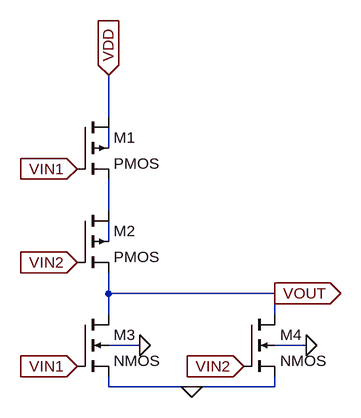
[diagram p0: schematic nor.asc]
nor.asc, the LTspice schematic file:
Version 4
SHEET 1 1100 680
WIRE 352 48 352 -16
WIRE 352 96 352 64
WIRE 352 192 352 144
WIRE 352 240 352 208
WIRE 352 320 352 288
WIRE 608 320 352 320
WIRE 352 352 352 320
WIRE 608 352 608 320
WIRE 400 400 352 400
WIRE 656 400 608 400
WIRE 352 464 352 448
WIRE 480 464 352 464
WIRE 608 464 608 448
WIRE 608 464 480 464
FLAG 304 128 VIN1
IOPIN 304 128 In
FLAG 304 272 VIN2
IOPIN 304 272 In
FLAG 352 -16 VDD
IOPIN 352 -16 In
FLAG 608 320 VOUT
IOPIN 608 320 Out
FLAG 400 400 0
FLAG 656 400 0
FLAG 480 464 0
FLAG 560 432 VIN2
IOPIN 560 432 In
FLAG 304 432 VIN1
IOPIN 304 432 In
SYMBOL pmos4 304 48 R0
SYMATTR InstName M1
SYMATTR Value2 l=90n w=400n
SYMBOL pmos4 304 192 R0
SYMATTR InstName M2
SYMATTR Value2 l=90n w=400n
SYMBOL nmos4 304 352 R0
SYMATTR InstName M3
SYMATTR Value2 l=90n w=200n
SYMBOL nmos4 560 352 R0
SYMATTR InstName M4
SYMATTR Value2 l=90n w=200n

The netlist it stands for:
* nor.asc
M1 VDD VIN1 N002 N001 PMOS l=90n w=400n
M2 N002 VIN2 VOUT N003 PMOS l=90n w=400n
M3 VOUT VIN1 0 0 NMOS l=90n w=200n
M4 VOUT VIN2 0 0 NMOS l=90n w=200n
.model NMOS NMOS
.model PMOS PMOS
.lib standard.mos
.backanno
.end